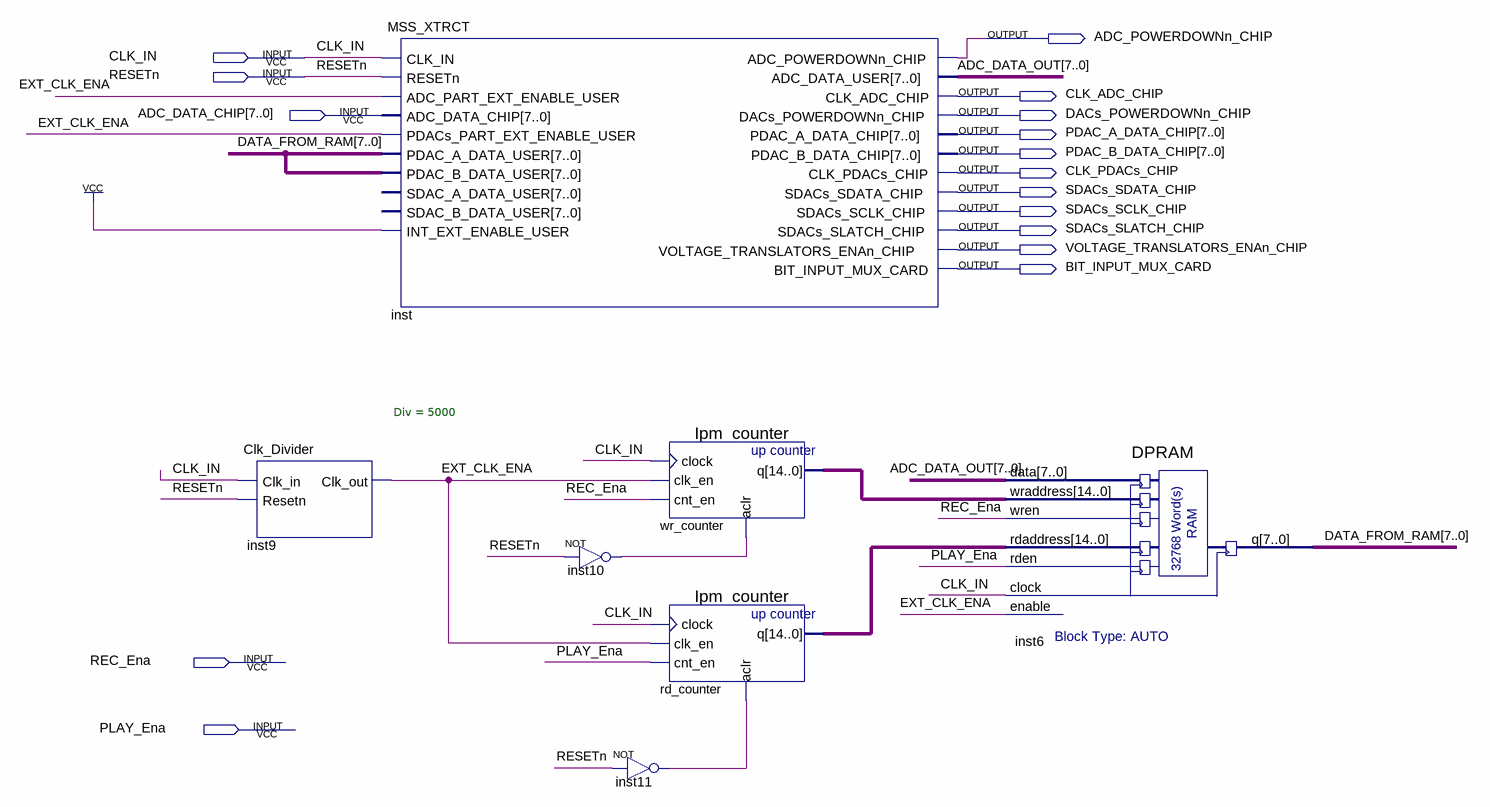
[diagram p0: schematic sheet]
// Quartus schematic MSS_dr.bdf as structural Verilog: 7 symbols, 16 pins
module MSS_dr (
  input  CLK_IN,
  input  RESETn,
  input  [7:0] ADC_DATA_CHIP,
  input  REC_Ena,
  input  PLAY_Ena,
  output ADC_POWERDOWNn_CHIP,
  output CLK_ADC_CHIP,
  output DACs_POWERDOWNn_CHIP,
  output [7:0] PDAC_A_DATA_CHIP,
  output [7:0] PDAC_B_DATA_CHIP,
  output CLK_PDACs_CHIP,
  output SDACs_SDATA_CHIP,
  output SDACs_SCLK_CHIP,
  output SDACs_SLATCH_CHIP,
  output VOLTAGE_TRANSLATORS_ENAn_CHIP,
  output BIT_INPUT_MUX_CARD
);

  wire EXT_CLK_ENA, inst10_out, inst11_out;
  wire [7:0] ADC_DATA_OUT, DATA_FROM_RAM;
  wire [14:0] rd_counter_q, wr_counter_q;

  Clk_Divider #(.Div(5000)) inst9 (.Clk_in(CLK_IN), .Resetn(RESETn), .Clk_out(EXT_CLK_ENA));
  MSS_XTRCT inst (
    .CLK_IN(CLK_IN), .RESETn(RESETn), .ADC_PART_EXT_ENABLE_USER(EXT_CLK_ENA), .ADC_DATA_CHIP(ADC_DATA_CHIP),
    .PDACs_PART_EXT_ENABLE_USER(EXT_CLK_ENA), .PDAC_A_DATA_USER(DATA_FROM_RAM),
    .PDAC_B_DATA_USER(DATA_FROM_RAM), .INT_EXT_ENABLE_USER(1'b1), .ADC_POWERDOWNn_CHIP(ADC_POWERDOWNn_CHIP),
    .ADC_DATA_USER(ADC_DATA_OUT), .CLK_ADC_CHIP(CLK_ADC_CHIP), .DACs_POWERDOWNn_CHIP(DACs_POWERDOWNn_CHIP),
    .PDAC_A_DATA_CHIP(PDAC_A_DATA_CHIP), .PDAC_B_DATA_CHIP(PDAC_B_DATA_CHIP),
    .CLK_PDACs_CHIP(CLK_PDACs_CHIP), .SDACs_SDATA_CHIP(SDACs_SDATA_CHIP), .SDACs_SCLK_CHIP(SDACs_SCLK_CHIP),
    .SDACs_SLATCH_CHIP(SDACs_SLATCH_CHIP), .VOLTAGE_TRANSLATORS_ENAn_CHIP(VOLTAGE_TRANSLATORS_ENAn_CHIP),
    .BIT_INPUT_MUX_CARD(BIT_INPUT_MUX_CARD));  // open: SDAC_A_DATA_USER, SDAC_B_DATA_USER
  not inst10 (inst10_out, RESETn);
  not inst11 (inst11_out, RESETn);
  Ipm_counter wr_counter (.clock(CLK_IN), .clk_en(EXT_CLK_ENA), .cnt_en(REC_Ena), .aclr(inst10_out), .q(wr_counter_q));
  Ipm_counter rd_counter (.clock(CLK_IN), .clk_en(EXT_CLK_ENA), .cnt_en(PLAY_Ena), .aclr(inst11_out), .q(rd_counter_q));
  DPRAM inst6 (
    .data(ADC_DATA_OUT), .wraddress(wr_counter_q), .wren(REC_Ena), .rdaddress(rd_counter_q), .rden(PLAY_Ena),
    .clock(CLK_IN), .enable(EXT_CLK_ENA), .q(DATA_FROM_RAM));
endmodule
